# Altium schematic sheet control_unit_v_1_1.SchDoc
size A4
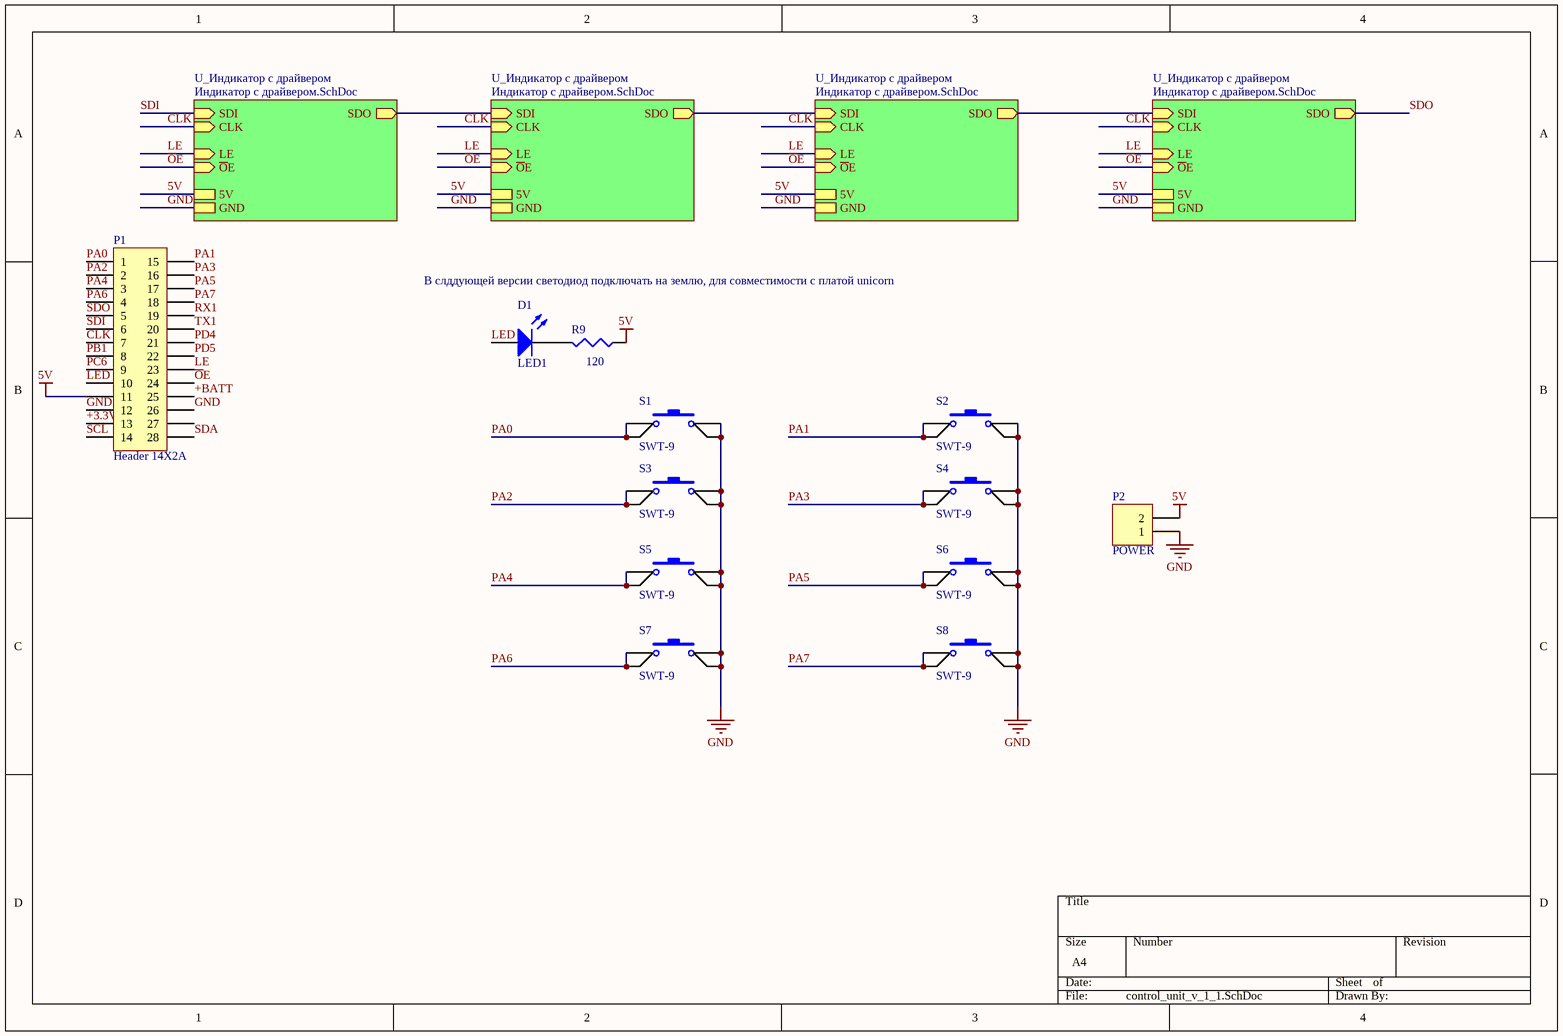
[diagram p0: control_unit_v_1_1.SchDoc]

## Parts
D1  LED1  [LED-1]
P1  Header 14X2A  [HDR2X14_CEN]
P2  POWER  [HDR1X2H]
R9  value 120  [RESC1608L]  (hidden comment: Res3)
S1  SWT-9  [SWT-9]
S2  SWT-9  [SWT-9]
S3  SWT-9  [SWT-9]
S4  SWT-9  [SWT-9]
S5  SWT-9  [SWT-9]
S6  SWT-9  [SWT-9]
S7  SWT-9  [SWT-9]
S8  SWT-9  [SWT-9]

## Sub-sheets
U_Индикатор с драйвером = Индикатор с драйвером.SchDoc: GND, ~{O}E (in), LE (in), CLK (in), SDI (in), 5V, SDO (out)
U_Индикатор с драйвером = Индикатор с драйвером.SchDoc: GND, ~{O}E (in), LE (in), CLK (in), SDI (in), 5V, SDO (out)
U_Индикатор с драйвером = Индикатор с драйвером.SchDoc: GND, ~{O}E (in), LE (in), CLK (in), SDI (in), 5V, SDO (out)
U_Индикатор с драйвером = Индикатор с драйвером.SchDoc: GND, ~{O}E (in), LE (in), CLK (in), SDI (in), 5V, SDO (out)

## Nets
5V: P1.11 P2.2 R9.1 ; sheet U_Индикатор с драйвером/5V, sheet U_Индикатор с драйвером/5V, sheet U_Индикатор с драйвером/5V, sheet U_Индикатор с драйвером/5V
GND: P1.12 P1.26 P2.1 S1.3 S1.4 S2.3 S2.4 S3.3 S3.4 S4.3 S4.4 S5.3 S5.4 S6.3 S6.4 S7.3 S7.4 S8.3 S8.4 ; sheet U_Индикатор с драйвером/GND, sheet U_Индикатор с драйвером/GND, sheet U_Индикатор с драйвером/GND, sheet U_Индикатор с драйвером/GND
+3.3V: P1.13
+BATT: P1.25
~{O}E: P1.24 ; sheet U_Индикатор с драйвером/~{O}E, sheet U_Индикатор с драйвером/~{O}E, sheet U_Индикатор с драйвером/~{O}E, sheet U_Индикатор с драйвером/~{O}E
CLK: P1.7 ; sheet U_Индикатор с драйвером/CLK, sheet U_Индикатор с драйвером/CLK, sheet U_Индикатор с драйвером/CLK, sheet U_Индикатор с драйвером/CLK
LE: P1.23 ; sheet U_Индикатор с драйвером/LE, sheet U_Индикатор с драйвером/LE, sheet U_Индикатор с драйвером/LE, sheet U_Индикатор с драйвером/LE
LED: D1.1(A) P1.10
PA0: P1.1 S1.1 S1.2
PA1: P1.15 S2.1 S2.2
PA2: P1.2 S3.1 S3.2
PA3: P1.16 S4.1 S4.2
PA4: P1.3 S5.1 S5.2
PA5: P1.17 S6.1 S6.2
PA6: P1.4 S7.1 S7.2
PA7: P1.18 S8.1 S8.2
PB1: P1.8
PC6: P1.9
PD4: P1.21
PD5: P1.22
RX1: P1.19
SCL: P1.14
SDA: P1.28
SDI: P1.6 ; sheet U_Индикатор с драйвером/SDI
SDO: P1.5 ; sheet U_Индикатор с драйвером/SDO
TX1: P1.20
NetD1_2: D1.2(K) R9.2
(unnamed): sheet U_Индикатор с драйвером/SDO, sheet U_Индикатор с драйвером/SDI
(unnamed): sheet U_Индикатор с драйвером/SDO, sheet U_Индикатор с драйвером/SDI
(unnamed): sheet U_Индикатор с драйвером/SDO, sheet U_Индикатор с драйвером/SDI

Not connected (* = marked no-connect by the designer): P1 27

## Notes on the sheet
- В слддующей версии светодиод подключать на землю, для совместимости с платой unicorn

## Library data of the parts
D1 = LED1: Typical RED GaAs LED; Published: 8-Jun-2000; LatestRevisionDate: 08-Jul-2005; LatestRevisionNote: Mech Layer 1 removed.; PackageReference: LED-1; Publisher: Altium Limited
P1 = Header 14X2A: Header, 14-Pin, Dual row; LatestRevisionDate: 17-Jul-2002; LatestRevisionNote: Re-released for DXP Platform.; Publisher: Altium Limited
P2 = Header 2H: Header, 2-Pin, Right Angle; LatestRevisionDate: 17-Jul-2002; LatestRevisionNote: Re-released for DXP Platform.; Publisher: Altium Limited
R9 = Res3: Resistor; Published: 8-Jun-2000; LatestRevisionDate: 29-May-2009; LatestRevisionNote: IPC-7351 Footprint Added.; PackageReference: J1-0603; Publisher: Altium Limited; PackageDescription: Chip Resistor
S1-S8 = SWT-9: Switch